# EAGLE design usb-i2c (EAGLE 6.5.0)
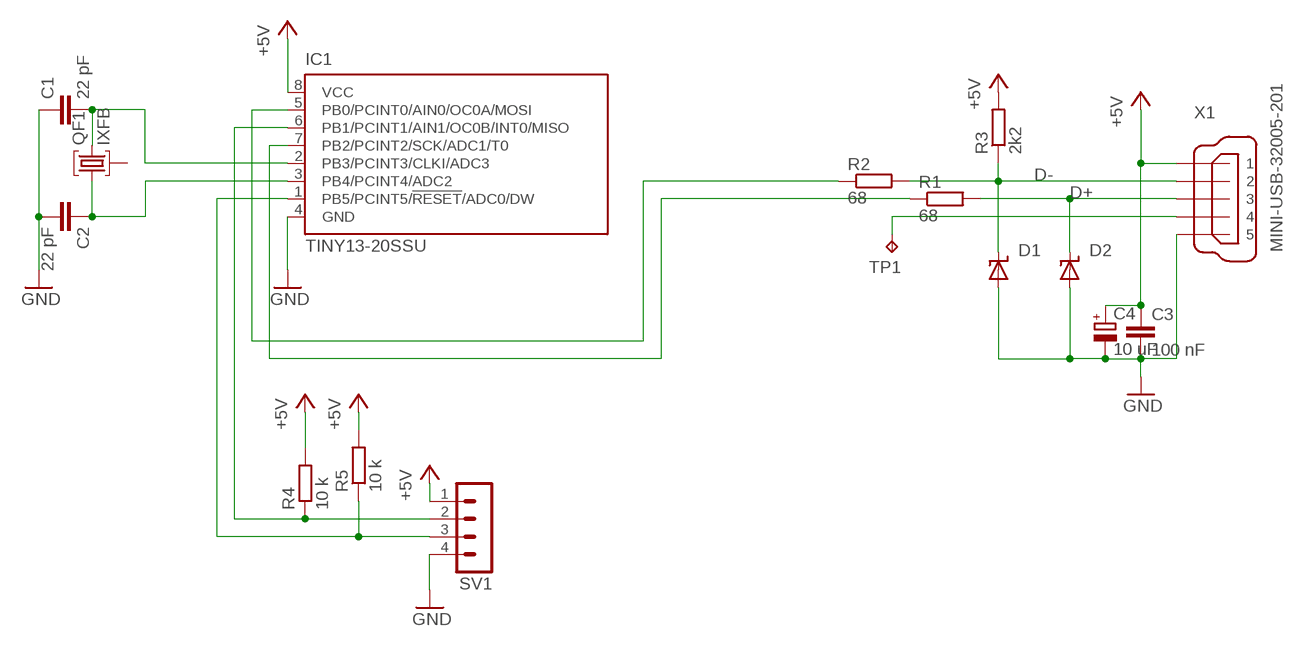
[diagram p0: schematic, sheet 1]

## Parts
C1  22 pF  C-EUC0603K  [C0603K]
C2  22 pF  C-EUC0603K  [C0603K]
C3  100 nF  C-EUC0603K  [C0603K]
C4  10 uF  CPOL-EUE2,5-6E  [E2,5-6E]
D1  SUPPRESSOR-SMBJ  [SMBJ]
D2  SUPPRESSOR-SMBJ  [SMBJ]
IC1  TINY13-20SSU  [8S1]
QF1  IXFB  [UM1]
R1  68  R-EU_R0603  [R0603]
R2  68  R-EU_R0603  [R0603]
R3  2k2  R-EU_R0603  [R0603]
R4  10 k  R-EU_R0603  [R0603]
R5  10 k  R-EU_R0603  [R0603]
SV1  MA04-1  [MA04-1]
TP1  TPB2,54  [B2,54]
X1  MINI-USB-32005-201  [32005-201]

## Nets
+5V: C3.1 C4.+ IC1.8(VCC) R3.2 R4.2 R5.2 SV1.1 X1.1
D+: D2.C R1.2 X1.3
D-: D1.C R2.2 R3.1 X1.2
GND: C1.1 C2.2 C3.2 C4.- D1.A D2.A IC1.4(GND) SV1.4 X1.5
N$1: IC1.5(PB0/PCINT0/AIN0/OC0A/MOSI) R2.1
N$2: C2.1 IC1.3(PB4/PCINT4/ADC2) QF1.1
N$3: C1.2 IC1.2(PB3/PCINT3/CLKI/ADC3) QF1.3
N$4: IC1.7(PB2/PCINT2/SCK/ADC1/T0) R1.1
N$5: IC1.6(PB1/PCINT1/AIN1/OC0B/INT0/MISO) R4.1 SV1.2
N$6: IC1.1(PB5/PCINT5/!RESET!/ADC0/DW) R5.1 SV1.3
N$7: TP1.TP X1.4
Unconnected: QF1.2

## Library data of the parts
C1-C3 = rcl:C-EU: CAPACITOR, European symbol
C4 = rcl:CPOL-EU: POLARIZED CAPACITOR, European symbol
D1 D2 = diode:SUPPRESSOR-: Suppressor diode
IC1 = atmel:TINY13: 8-bit AVR Microcontroller with 1K Bytes In-System Programmable Flash Source: http://www.atmel.com/dyn/resources/prod_documents/2535S.pdf; MPN: ATTINY13-20SSU; OC_FARNELL: 1455133; OC_NEWARK: 58M3771
QF1 = crystal:IXF: Crystal Filter Source: www.ilsiamerica.com .. C1 IXF Series.pdf; OC_FARNELL: unknown; OC_NEWARK: unknown
R1-R5 = rcl:R-EU_: RESISTOR, European symbol
SV1 = con-lstb:MA04-1: PIN HEADER; OC_FARNELL: unknown; OC_NEWARK: unknown
TP1 = testpad:TP: Test pad
X1 = con-cypressindustries:MINI-USB-: MINI USB-B Conector Source: www.cypressindustries.com; OC_FARNELL: unknown; OC_NEWARK: unknown

## Board
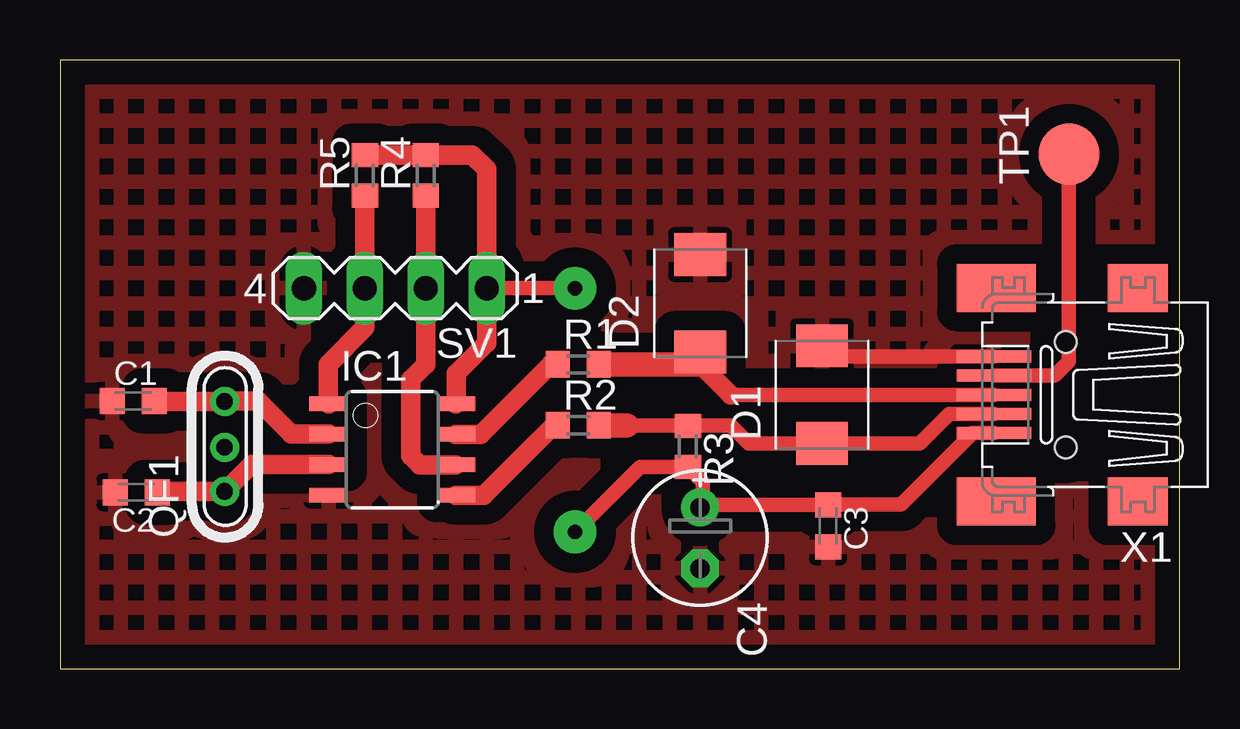
[diagram p1: board, top side]
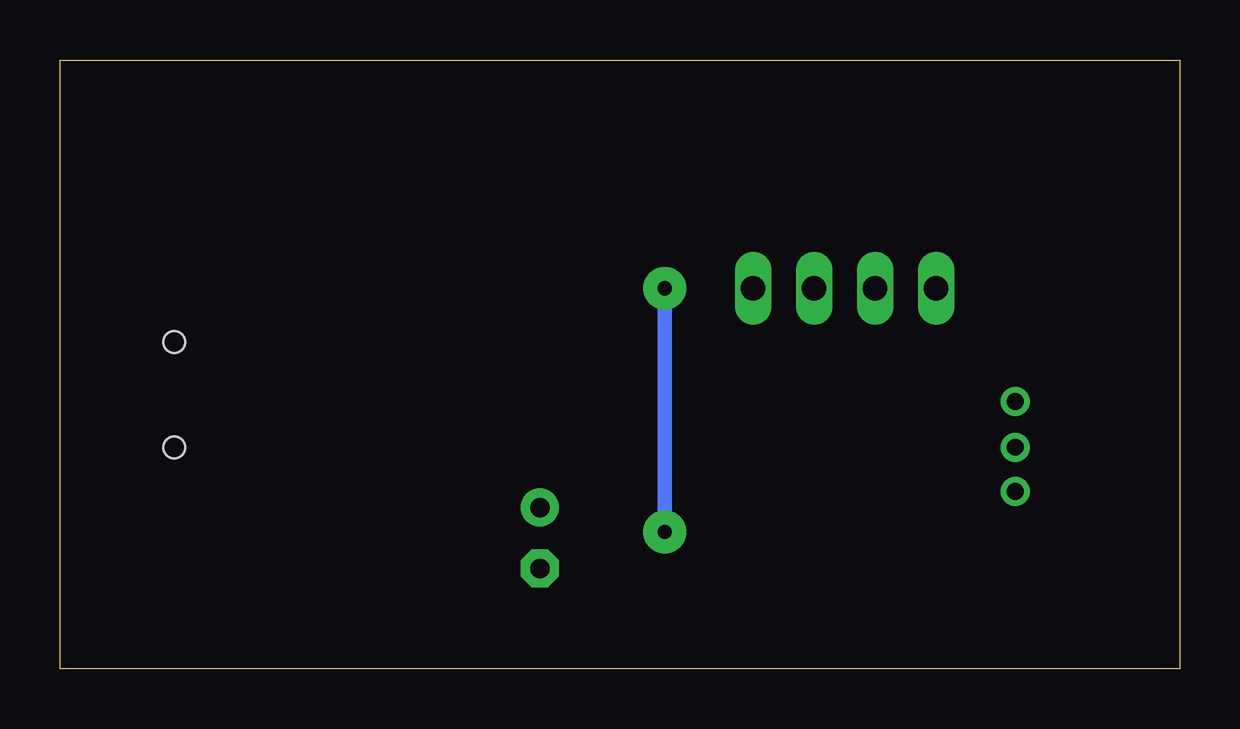
[diagram p2: board, bottom side, seen from below]

Size 46.66 x 25.39 mm. Coordinates in mm from the lower left corner, seen from the top.
Outline: 0,0 46.66,0 46.66,25.39 0,25.39 0,0
Copper layers (1*16): Top 0.035mm / dielectric 1.5mm / Bottom 0.035mm
Design rules "default": minimum track width 10mil, minimum drill 24mil, track to track 8mil, track to pad 8mil, pad to pad 8mil, via to via 8mil, smd to smd 8mil, copper to edge 40mil, drill to drill 8mil, minimum pad ring 10mil, minimum via ring 8mil, stop-mask expansion 4mil, vias tented up to drill 0mil, thermal gap 10mil

### Footprints (pad centres in the part's own frame; a part is rotated, then mirrored left to right if it is on the bottom)
C0603K = smd 1.05 x 1.08: 1 -0.875,0; 2 0.875,0
E2,5-6E = drill 0.813 pad 1.575: + -1.27,0 | drill 0.813 pad 1.575 octagon: - 1.27,0
SMBJ = smd 1.78 x 2.16: A 2.04,0; C -2.03,0
8S1 = smd 0.6 x 1.6: 1 -1.905,-2.654; 2 -0.645,-2.654; 3 0.625,-2.654; 4 1.895,-2.654; 5 1.905,2.654; 6 0.635,2.654; 7 -0.635,2.654; 8 -1.905,2.654
UM1 = drill 0.7 pad 1.2: 1 -1.875,0; 2 -0.027,0; 3 1.875,0
R0603 = smd 1 x 1.1: 1 -0.85,0; 2 0.85,0
MA04-1 = drill 1.016 long: 1 -3.81,0; 2 -1.27,0; 3 1.27,0; 4 3.81,0
B2,54 = smd 2.54 x 2.54: TP 0,0
32005-201 = smd 3.1 x 0.5: 1 3,1.6; 2 3,0.8; 3 3,0; 4 3,-0.8; 5 3,-1.6 | smd 2.5 x 2: M1 -3,-4.45; M2 -3,4.45 | smd 3.3 x 2: M3 2.9,4.45; M4 2.9,-4.45 | hole 0.9: 0,2.2; 0,-2.2

### Placement (x,y rotation side)
C1  3.05,11.18 0 top
C2  3.17,7.37 180 top
C3  32,5.97 270 top
C4  26.67,5.46 270 top
D1  31.75,11.43 90 top
D2  26.67,15.24 90 top
IC1  13.84,9.14 270 top
QF1  6.86,9.27 90 top
R1  21.59,12.7 0 top
R2  21.59,10.16 0 top
R3  26.16,9.27 270 top
R4  15.24,20.57 90 top
R5  12.7,20.57 90 top
SV1  13.97,15.88 180 top
TP1  42.04,21.46 90 top
X1  41.91,11.43 180 top

### Tracks (layer width: path | path; a pad name or v marks a point on that pad's centre or on a via)
+5V  (via drill 0.6 pad 1.78)
  Top 0.61: X1.1 38.02,9.83 35.05,6.86 32.02,6.86 C3.1 26.78,6.84 | 26.78,6.84 C4.+ | 26.78,6.84 26.78,7.8 R3.2 24.17,8.42 v21.46,5.71 | v21.46,15.88 SV1.1
  Top 0.813: IC1.8 16.51,11.06 16.51,12.32 17.78,13.59 SV1.1 17.78,20.83 17.18,21.42 R4.2 R5.2
  Bottom 0.61: v21.46,5.71 v21.46,15.88
D+
  Top 0.61: 26.67,12.7 D2.C | X1.3 27.94,11.43
  Top 0.813: 27.94,11.43 26.67,12.7
  Top 1.016: R1.2 26.67,12.7
D-
  Top 0.61: X1.2 37.05,10.63 35.81,9.4 D1.C | D1.C | D1.C 28.7,9.4 27.94,10.16 26.54,10.16 | 26.54,10.16 23.62,10.16 | R3.1 26.5,10.12 26.54,10.16
  Top 1.016: 23.62,10.16 R2.2
GND
  Top 0.61: X1.5 32.19,13.03 D1.A
  pour Top (isolate 0.813, hatched): 0,25.4 45.72,25.4 45.72,0 0,0
N$1
  Top 0.813: R2.1 20.57,10.16 17.65,7.24 IC1.5
N$2
  Top 0.813: IC1.3 7.98,8.52 QF1.1 4.08,7.4 C2.1
N$3
  Top 0.813: IC1.2 9.64,9.79 8.26,11.18 6.89,11.18 QF1.3 3.95,11.15 C1.2
N$4
  Top 0.813: R1.1 20.45,12.7 17.53,9.78 IC1.7
N$5
  Top 0.813: IC1.6 14.99,8.51 14.61,8.89 14.61,12.06 15.24,12.7 SV1.2 R4.1
N$6
  Top 0.813: IC1.1 11.18,11.06 11.18,12.7 12.7,14.22 SV1.3 R5.1
N$7
  Top 0.61: X1.4 41.44,12.23 42.04,12.83 TP1.TP